# EAGLE design StackUnderflow (EAGLE 5.06)
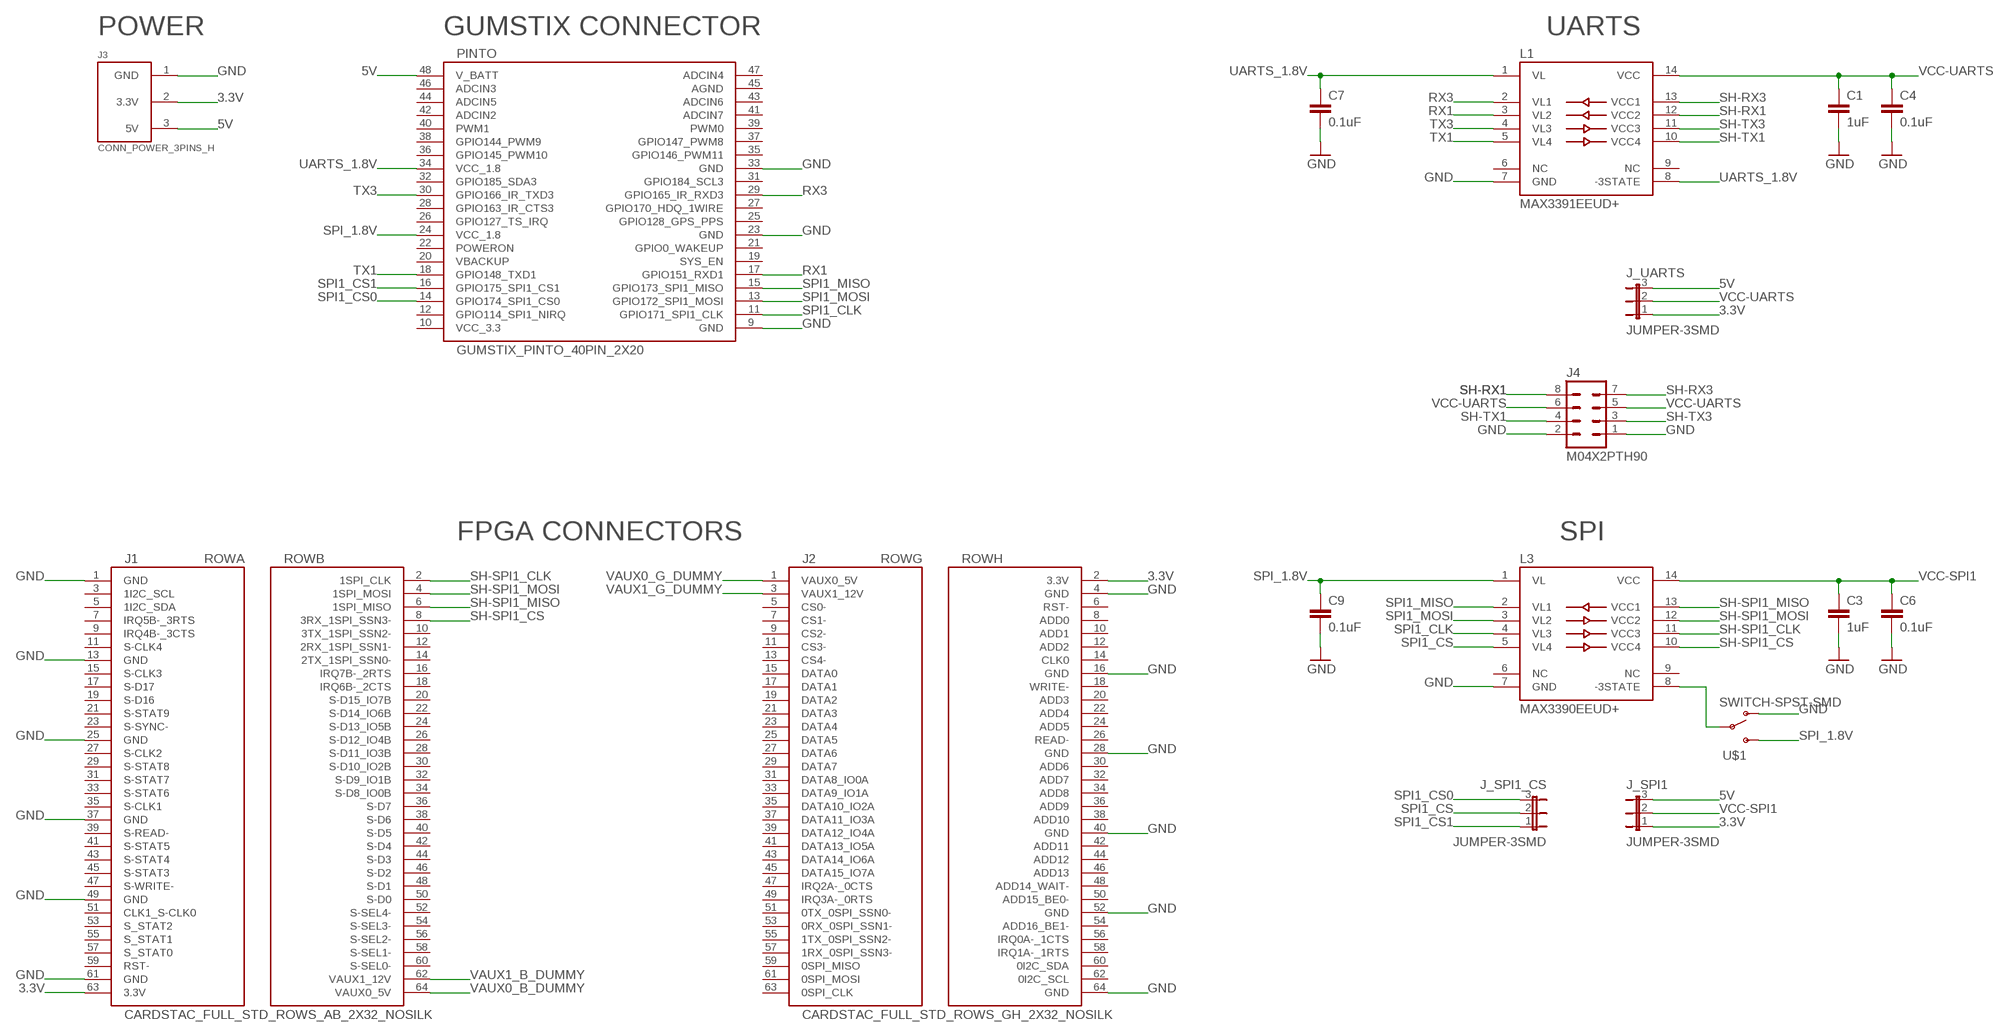
[diagram p0: schematic, sheet 1]

## Parts
C1  1uF  CAP0805  [C0805]
C3  1uF  CAP0805  [C0805]
C4  0.1uF  CAP0805  [C0805]
C6  0.1uF  CAP0805  [C0805]
C7  0.1uF  CAP0805  [C0805]
C9  0.1uF  CAP0805  [C0805]
J1  CARDSTAC_FULL_STD_ROWS_AB_2X32_NOSILK  [2X32/NOSILK]
J2  CARDSTAC_FULL_STD_ROWS_GH_2X32_NOSILK  [2X32/NOSILK]
J3  CONN_POWER_3PINS_H  [3PINS_3.81MM_90DEG]
J4  M04X2PTH90  [2X04/90]
J_SPI1  JUMPER-3SMD  [SJ_3]
J_SPI1_CS  JUMPER-3SMD  [SJ_3]
J_UARTS  JUMPER-3SMD  [SJ_3]
L1  MAX3391EEUD+  [TSSOP-14]
L3  MAX3390EEUD+  [TSSOP-14]
PINTO  GUMSTIX_PINTO_40PIN_2X20  [GUMSTIX_PINTO_40PIN]
U$1  SWITCH-SPST-SMD  [SWITCH-SPST-SMD]

## Nets
3.3V: J1.63(3.3V) J2.2(3.3V) J3.2(3.3V) J_SPI1.1 J_UARTS.1
5V: J3.3(5V) J_SPI1.3 J_UARTS.3 PINTO.48(V_BATT)
GND: C1.2 C3.2 C4.2 C6.2 C7.2 C9.2 J1.1(GND) J1.13(GND) J1.25(GND) J1.37(GND) J1.49(GND) J1.61(GND) J2.4(GND) J2.16(GND) J2.28(GND) J2.40(GND) J2.52(GND) J2.64(GND) J3.1(GND) J4.1 J4.2 L1.7(GND) L3.7(GND) PINTO.9(GND) PINTO.23(GND) PINTO.33(GND) U$1.1(O)
RX1: L1.3(VL2) PINTO.17(GPIO151_RXD1)
RX3: L1.2(VL1) PINTO.29(GPIO165_IR_RXD3)
SH-RX1: J4.8 L1.12(VCC2)
SH-RX3: J4.7 L1.13(VCC1)
SH-SPI1_CLK: J1.2(1SPI_CLK) L3.11(VCC3)
SH-SPI1_CS: J1.8(3RX_1SPI_SSN3-) L3.10(VCC4)
SH-SPI1_MISO: J1.6(1SPI_MISO) L3.13(VCC1)
SH-SPI1_MOSI: J1.4(1SPI_MOSI) L3.12(VCC2)
SH-TX1: J4.4 L1.10(VCC4)
SH-TX3: J4.3 L1.11(VCC3)
SPI1_CLK: L3.4(VL3) PINTO.11(GPIO171_SPI1_CLK)
SPI1_CS: J_SPI1_CS.2 L3.5(VL4)
SPI1_CS0: J_SPI1_CS.3 PINTO.14(GPIO174_SPI1_CS0)
SPI1_CS1: J_SPI1_CS.1 PINTO.16(GPIO175_SPI1_CS1)
SPI1_MISO: L3.2(VL1) PINTO.15(GPIO173_SPI1_MISO)
SPI1_MOSI: L3.3(VL2) PINTO.13(GPIO172_SPI1_MOSI)
SPI_1.8V: C9.1 L3.1(VL) PINTO.24(VCC_1.8) U$1.3(S)
SPI_ENABLE: L3.8(-3STATE) U$1.2(P)
TX1: L1.5(VL4) PINTO.18(GPIO148_TXD1)
TX3: L1.4(VL3) PINTO.30(GPIO166_IR_TXD3)
UARTS_1.8V: C7.1 L1.1(VL) L1.8(-3STATE) PINTO.34(VCC_1.8)
VAUX0_B_DUMMY: J1.64(VAUX0_5V)
VAUX0_G_DUMMY: J2.1(VAUX0_5V)
VAUX1_B_DUMMY: J1.62(VAUX1_12V)
VAUX1_G_DUMMY: J2.3(VAUX1_12V)
VCC-SPI1: C3.1 C6.1 J_SPI1.2 L3.14(VCC)
VCC-UARTS: C1.1 C4.1 J4.5 J4.6 J_UARTS.2 L1.14(VCC)
Unconnected: J1.3(1I2C_SCL) J1.5(1I2C_SDA) J1.7(IRQ5B-_3RTS) J1.9(IRQ4B-_3CTS) J1.10(3TX_1SPI_SSN2-) J1.11(S-CLK4) J1.12(2RX_1SPI_SSN1-) J1.14(2TX_1SPI_SSN0-) J1.15(S-CLK3) J1.16(IRQ7B-_2RTS) J1.17(S-D17) J1.18(IRQ6B-_2CTS) J1.19(S-D16) J1.20(S-D15_IO7B) J1.21(S-STAT9) J1.22(S-D14_IO6B) J1.23(S-SYNC-) J1.24(S-D13_IO5B) J1.26(S-D12_IO4B) J1.27(S-CLK2) J1.28(S-D11_IO3B) J1.29(S-STAT8) J1.30(S-D10_IO2B) J1.31(S-STAT7) J1.32(S-D9_IO1B) J1.33(S-STAT6) J1.34(S-D8_IO0B) J1.35(S-CLK1) J1.36(S-D7) J1.38(S-D6) J1.39(S-READ-) J1.40(S-D5) J1.41(S-STAT5) J1.42(S-D4) J1.43(S-STAT4) J1.44(S-D3) J1.45(S-STAT3) J1.46(S-D2) J1.47(S-WRITE-) J1.48(S-D1) J1.50(S-D0) J1.51(CLK1_S-CLK0) J1.52(S-SEL4-) J1.53(S_STAT2) J1.54(S-SEL3-) J1.55(S_STAT1) J1.56(S-SEL2-) J1.57(S_STAT0) J1.58(S-SEL1-) J1.59(RST-) J1.60(S-SEL0-) J2.5(CS0-) J2.6(RST-) J2.7(CS1-) J2.8(ADD0) J2.9(CS2-) J2.10(ADD1) J2.11(CS3-) J2.12(ADD2) J2.13(CS4-) J2.14(CLK0) J2.15(DATA0) J2.17(DATA1) J2.18(WRITE-) J2.19(DATA2) J2.20(ADD3) J2.21(DATA3) J2.22(ADD4) J2.23(DATA4) J2.24(ADD5) J2.25(DATA5) J2.26(READ-) J2.27(DATA6) J2.29(DATA7) J2.30(ADD6) J2.31(DATA8_IO0A) J2.32(ADD7) J2.33(DATA9_IO1A) J2.34(ADD8) J2.35(DATA10_IO2A) J2.36(ADD9) J2.37(DATA11_IO3A) J2.38(ADD10) J2.39(DATA12_IO4A) J2.41(DATA13_IO5A) J2.42(ADD11) J2.43(DATA14_IO6A) J2.44(ADD12) J2.45(DATA15_IO7A) J2.46(ADD13) J2.47(IRQ2A-_0CTS) J2.48(ADD14_WAIT-) J2.49(IRQ3A-_0RTS) J2.50(ADD15_BE0-) J2.51(0TX_0SPI_SSN0-) J2.53(0RX_0SPI_SSN1-) J2.54(ADD16_BE1-) J2.55(1TX_0SPI_SSN2-) J2.56(IRQ0A-_1CTS) J2.57(1RX_0SPI_SSN3-) J2.58(IRQ1A-_1RTS) J2.59(0SPI_MISO) J2.60(0I2C_SDA) J2.61(0SPI_MOSI) J2.62(0I2C_SCL) J2.63(0SPI_CLK) L1.6(NC) L1.9(NC) L3.6(NC) L3.9(NC) PINTO.10(VCC_3.3) PINTO.12(GPIO114_SPI1_NIRQ) PINTO.19(SYS_EN) PINTO.20(VBACKUP) PINTO.21(GPIO0_WAKEUP) PINTO.22(POWERON) PINTO.25(GPIO128_GPS_PPS) PINTO.26(GPIO127_TS_IRQ) PINTO.27(GPIO170_HDQ_1WIRE) PINTO.28(GPIO163_IR_CTS3) PINTO.31(GPIO184_SCL3) PINTO.32(GPIO185_SDA3) PINTO.35(GPIO146_PWM11) PINTO.36(GPIO145_PWM10) PINTO.37(GPIO147_PWM8) PINTO.38(GPIO144_PWM9) PINTO.39(PWM0) PINTO.40(PWM1) PINTO.41(ADCIN7) PINTO.42(ADCIN2) PINTO.43(ADCIN6) PINTO.44(ADCIN5) PINTO.45(AGND) PINTO.46(ADCIN3) PINTO.47(ADCIN4)

## Notes on the sheet
- POWER | GUMSTIX CONNECTOR | UARTS
- FPGA CONNECTORS | SPI

## Library data of the parts
C1 C3 C4 C6 C7 C9 = Robot:CAP: CAPACITOR
J1 = Robot:CARDSTAC_FULL_STD_ROWS_AB: Rows A and B of the Cardstac specification.
J2 = Robot:CARDSTAC_FULL_STD_ROWS_GH: Rows G and H of the Cardstac specification.
J3 = Robot:CONN_POWER_3PINS: POWER CONNECTOR for logic boards. Provides 3.3V and 5V.
J4 = Robot:M04X2: 8-PIN DUAL ROW HEADER Standard 8-pin dual row 0.1" header.
J_SPI1 J_SPI1_CS J_UARTS = Robot:JUMPER-3: 3-WAY JUMPER
L1 = Robot:MAX3391E: Low-Voltage Level Translator Page du fabricant: http://www.maxim-ic.com/quick_view2.cfm/qv_pk/3253 Datasheet: http://datasheets.maxim-ic.com/en/ds/MAX3372E-MAX3393E.pdf
L3 = Robot:MAX3390E: Low-Voltage Level Translator Page du fabricant: http://www.maxim-ic.com/quick_view2.cfm/qv_pk/3253 Datasheet: http://datasheets.maxim-ic.com/en/ds/MAX3372E-MAX3393E.pdf
PINTO = Robot:GUMSTIX_PINTO_40PIN: Expansion connector of the Pinto daughterboard for Gumstix Overo COMs
U$1 = Robot:SWITCH-SPST: SPST Switch

## Board
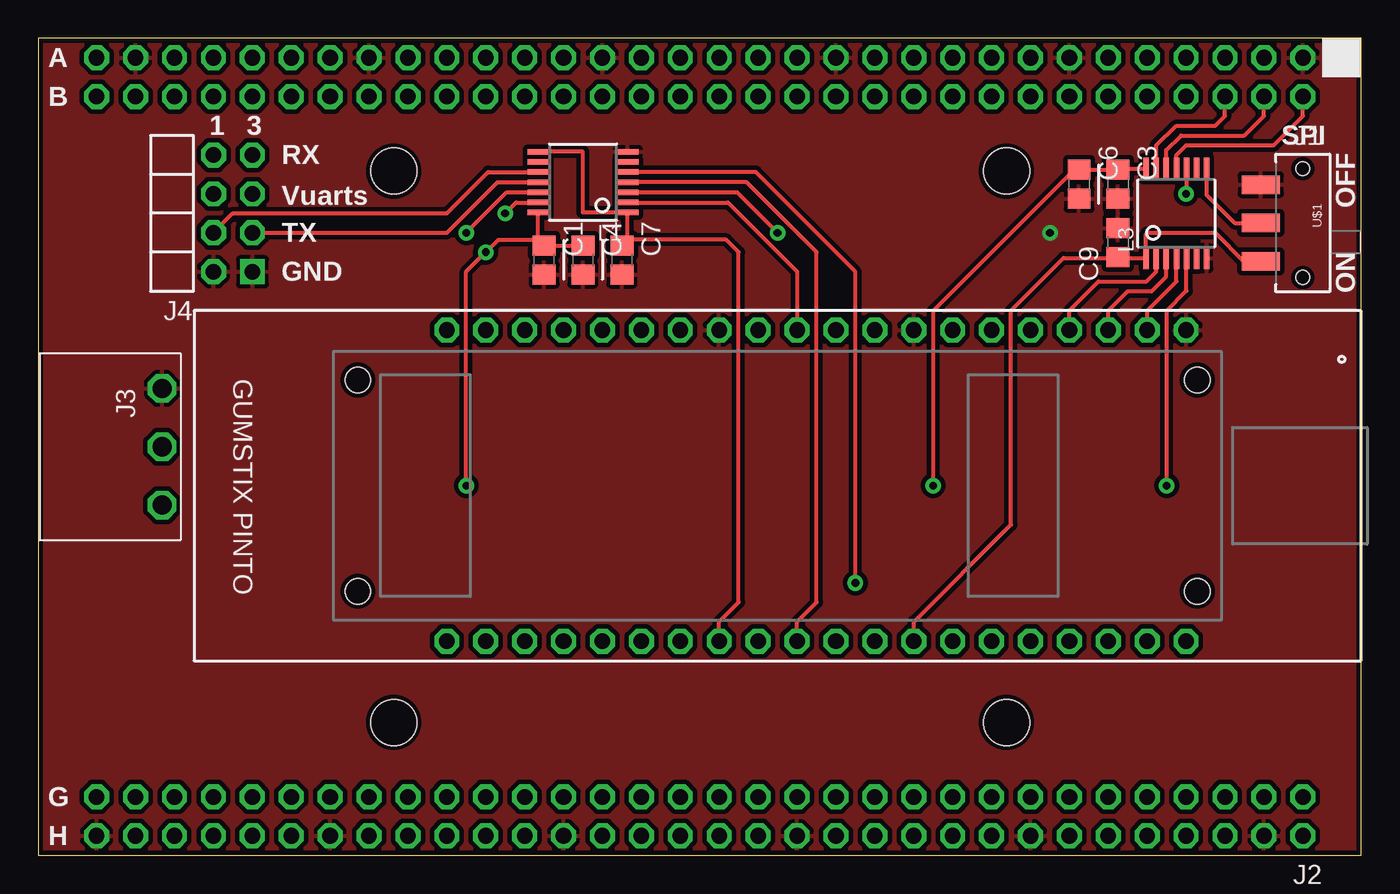
[diagram p1: board, top side]
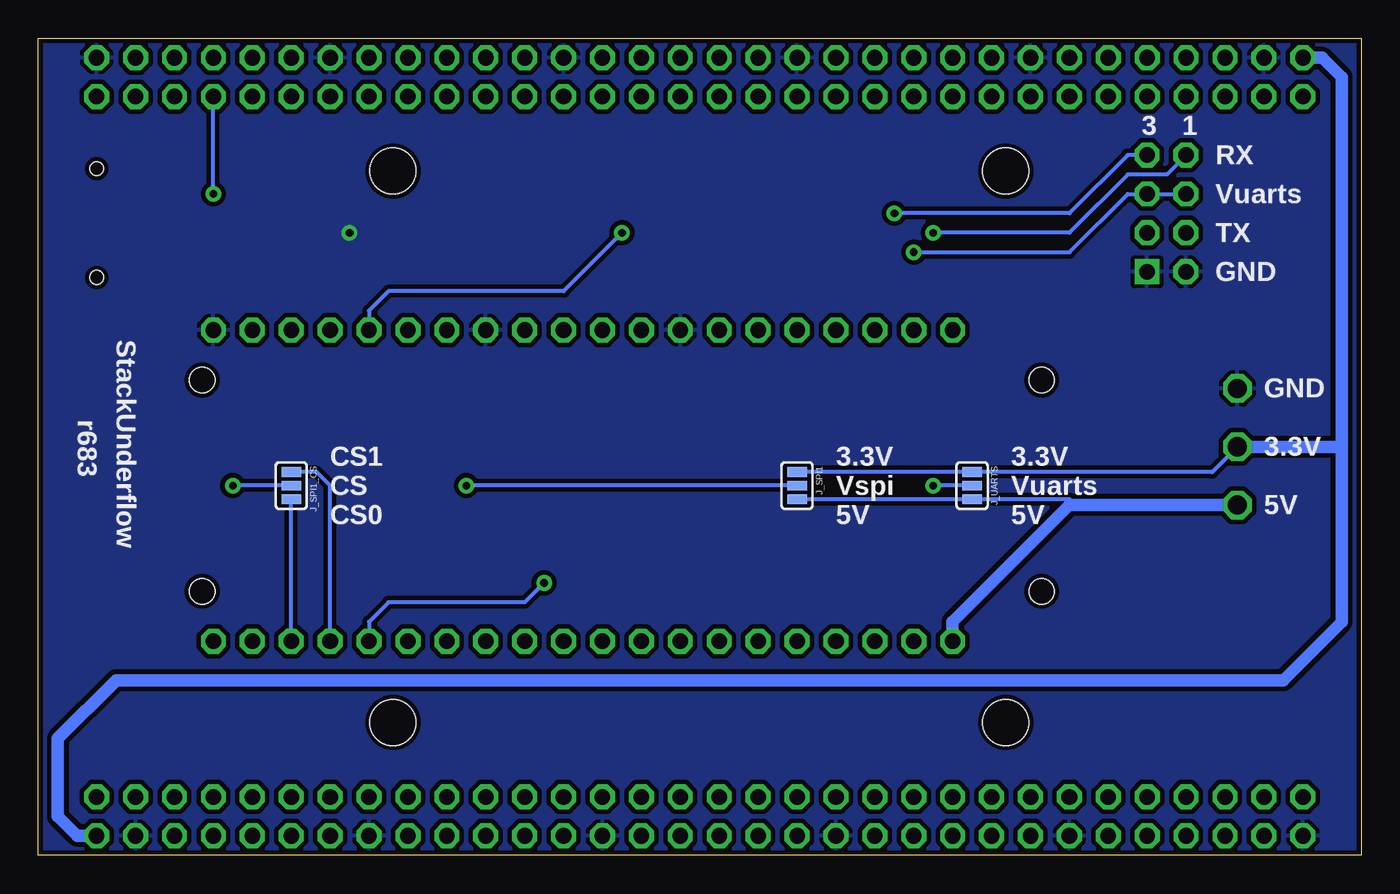
[diagram p2: board, bottom side, seen from below]

Size 86.36 x 53.34 mm. Coordinates in mm from the lower left corner, seen from the top.
Outline: 0,0 86.36,0 86.36,53.34 0,53.34 0,0
Copper layers (1*16): Top 0.035mm / dielectric 1.5mm / Bottom 0.035mm
Design rules "SparkFun": minimum track width 8mil, minimum drill 20mil, track to track 8mil, track to pad 8mil, pad to pad 8mil, via to via 8mil, smd to smd 8mil, copper to edge 10mil, drill to drill 8mil, minimum pad ring 12mil, minimum via ring 10mil, stop-mask expansion 4mil, vias tented up to drill 25mil, thermal gap 10mil
Holes 3 mm at 23.2,44.67 63.2,44.67 23.2,8.67 63.2,8.67

### Footprints (pad centres in the part's own frame; a part is rotated, then mirrored left to right if it is on the bottom)
C0805 = smd 1.3 x 1.5: 1 -0.95,0; 2 0.95,0
2X32/NOSILK = drill 1.016 octagon: 1 -39.37,-1.27; 2 -39.37,1.27; 3 -36.83,-1.27; 4 -36.83,1.27; 5 -34.29,-1.27; 6 -34.29,1.27; 7 -31.75,-1.27; 8 -31.75,1.27; 9 -29.21,-1.27; 10 -29.21,1.27; 11 -26.67,-1.27; 12 -26.67,1.27; 13 -24.13,-1.27; 14 -24.13,1.27; 15 -21.59,-1.27; 16 -21.59,1.27; 17 -19.05,-1.27; 18 -19.05,1.27; 19 -16.51,-1.27; 20 -16.51,1.27; 21 -13.97,-1.27; 22 -13.97,1.27; 23 -11.43,-1.27; 24 -11.43,1.27; 25 -8.89,-1.27; 26 -8.89,1.27; 27 -6.35,-1.27; 28 -6.35,1.27; 29 -3.81,-1.27; 30 -3.81,1.27; 31 -1.27,-1.27; 32 -1.27,1.27; 33 1.27,-1.27; 34 1.27,1.27; 35 3.81,-1.27; 36 3.81,1.27; 37 6.35,-1.27; 38 6.35,1.27; 39 8.89,-1.27; 40 8.89,1.27; 41 11.43,-1.27; 42 11.43,1.27; 43 13.97,-1.27; 44 13.97,1.27; 45 16.51,-1.27; 46 16.51,1.27; 47 19.05,-1.27; 48 19.05,1.27; 49 21.59,-1.27; 50 21.59,1.27; 51 24.13,-1.27; 52 24.13,1.27; 53 26.67,-1.27; 54 26.67,1.27; 55 29.21,-1.27; 56 29.21,1.27; 57 31.75,-1.27; 58 31.75,1.27; 59 34.29,-1.27; 60 34.29,1.27; 61 36.83,-1.27; 62 36.83,1.27; 63 39.37,-1.27; 64 39.37,1.27
3PINS_3.81MM_90DEG = drill 1.25 octagon: 1 -3.81,3; 2 0,3; 3 3.81,3
2X04/90 = drill 1.016 square: 1 -3.81,-1.28 | drill 1.016 octagon: 2 -3.81,1.26; 3 -1.27,-1.28; 4 -1.27,1.26; 5 1.27,-1.28; 6 1.27,1.26; 7 3.81,-1.28; 8 3.81,1.26
SJ_3 = smd 0.635 x 1.27: 1 -0.889,0; 2 0,0; 3 0.889,0
TSSOP-14 = smd 1.422 x 0.356: 1 -2.921,1.981; 2 -2.921,1.321; 3 -2.921,0.66; 4 -2.921,0; 5 -2.921,-0.66; 6 -2.921,-1.321; 7 -2.921,-1.981; 8 2.921,-1.981; 9 2.921,-1.321; 10 2.921,-0.66; 11 2.921,0; 12 2.921,0.66; 13 2.921,1.321; 14 2.921,1.981
GUMSTIX_PINTO_40PIN = drill 1.016 octagon: 9 64.77,21.59; 10 64.77,1.27; 11 62.23,21.59; 12 62.23,1.27; 13 59.69,21.59; 14 59.69,1.27; 15 57.15,21.59; 16 57.15,1.27; 17 54.61,21.59; 18 54.61,1.27; 19 52.07,21.59; 20 52.07,1.27; 21 49.53,21.59; 22 49.53,1.27; 23 46.99,21.59; 24 46.99,1.27; 25 44.45,21.59; 26 44.45,1.27; 27 41.91,21.59; 28 41.91,1.27; 29 39.37,21.59; 30 39.37,1.27; 31 36.83,21.59; 32 36.83,1.27; 33 34.29,21.59; 34 34.29,1.27; 35 31.75,21.59; 36 31.75,1.27; 37 29.21,21.59; 38 29.21,1.27; 39 26.67,21.59; 40 26.67,1.27; 41 24.13,21.59; 42 24.13,1.27; 43 21.59,21.59; 44 21.59,1.27; 45 19.05,21.59; 46 19.05,1.27; 47 16.51,21.59; 48 16.51,1.27 | hole 1.65: 65.5,18.33; 65.5,4.53; 10.7,18.33; 10.7,4.53
SWITCH-SPST-SMD = smd 1.2 x 2.5: 1 -2.5,-2.75; 2 0,-2.75; 3 2.5,-2.75 | hole 0.9: -3.55,0; 3.55,0

### Placement (x,y rotation side)
C1  33.02,38.86 270 top
C3  70.48,43.81 270 top
C4  35.56,38.86 270 top
C6  67.94,43.81 270 top
C7  38.1,38.86 270 top
C9  70.48,40.01 90 top
J1  43.18,50.8 180 top
J2  43.18,2.54 180 top
J3  5.08,26.67 270 top
J4  12.7,41.91 90 top
J_SPI1  36.83,24.13 270 bottom
J_SPI1_CS  69.85,24.13 270 bottom
J_UARTS  25.4,24.13 270 bottom
L1  35.56,43.94 180 top
L3  74.3,41.91 90 top
PINTO  10.16,12.7 0 top
U$1  82.55,41.27 270 top

### Tracks (layer width: path | path; a pad name or v marks a point on that pad's centre or on a via)
3.3V
  Bottom 0.254: J_SPI1.1 J_UARTS.1 9.73,25.02 J3.2
  Bottom 0.813: 1.27,26.67 J3.2 | 1.27,26.67 1.27,15.24 5.08,11.43 81.28,11.43 85.09,7.62 85.09,2.54 83.82,1.27 J2.2 | J1.63 2.54,52.07 1.27,50.8 1.27,26.67
5V
  Bottom 0.254: J_SPI1.3 J_UARTS.3 19.05,23.24 19.05,22.86
  Bottom 0.813: J3.3 19.05,22.86 26.67,15.24 PINTO.48
GND  (via drill 0.51)
  other vias: 66.04,40.64
  pour Bottom (isolate 0.305): 0,0 0,53.34 86.36,53.34 86.36,0
  pour Top (isolate 0.305): 0,0 0,53.34 86.36,53.34 86.36,0
RX1  (via drill 0.51)
  Top 0.254: L1.3 45.62,43.28 v48.26,40.64
  Bottom 0.254: v48.26,40.64 52.07,36.83 63.5,36.83 64.77,35.56 PINTO.17
RX3
  Top 0.254: PINTO.29 49.53,38.1 45.01,42.62 L1.2
SH-RX1  (via drill 0.51)
  Top 0.254: L1.12 30.58,43.28 v27.94,40.64
  Bottom 0.254: J4.8 12.7,44.45 15.24,44.45 19.05,40.64 v27.94,40.64
SH-RX3  (via drill 0.51)
  Top 0.254: L1.13 31.19,42.62 v30.48,41.91
  Bottom 0.254: J4.7 15.24,45.72 19.05,41.91 v30.48,41.91
SH-SPI1_CLK
  Top 0.254: L3.11 74.3,45.72 74.93,46.35 80.64,46.35 82.55,48.26 J1.2
SH-SPI1_CS  (via drill 0.51)
  Top 0.254: L3.10 74.93,44.83 v74.93,43.18
  Bottom 0.254: v74.93,43.18 J1.8
SH-SPI1_MISO
  Top 0.254: L3.13 72.97,46.35 74.3,47.62 76.83,47.62 77.47,48.26 J1.6
SH-SPI1_MOSI
  Top 0.254: L3.12 73.64,46.04 74.61,46.99 78.74,46.99 80.01,48.26 J1.4
SH-TX1
  Top 0.254: J4.4 12.7,41.91 26.67,41.91 29.36,44.6 L1.10
SH-TX3
  Top 0.254: J4.3 26.67,40.64 29.97,43.94 L1.11
SPI1_CLK
  Top 0.254: PINTO.11 72.39,35.56 74.3,37.47 L3.4
SPI1_CS  (via drill 0.51)
  Top 0.254: v73.66,24.13 73.66,35.56 74.95,36.85 L3.5
  Bottom 0.254: J_SPI1_CS.2 v73.66,24.13
SPI1_CS0
  Bottom 0.254: PINTO.14 J_SPI1_CS.3
SPI1_CS1
  Bottom 0.254: J_SPI1_CS.1 68.2,25.02 67.31,24.13 PINTO.16
SPI1_MISO
  Top 0.254: PINTO.15 67.31,35.56 69.22,37.47 72.34,37.47 72.97,38.1 L3.2
SPI1_MOSI
  Top 0.254: PINTO.13 69.85,35.56 71.12,36.83 72.68,36.83 73.64,37.78 L3.3
SPI_1.8V
  Top 0.254: PINTO.24 57.15,15.24 63.5,21.59 63.5,35.56 66.93,38.99 70.48,38.99 | U$1.3 78.7,38.77 76.83,40.64 72.39,40.64 72.31,40.56 L3.1 70.48,38.99 | 70.48,38.99 C9.1
SPI_ENABLE
  Top 0.254: L3.8 76.28,43.1 78.11,41.27 U$1.2
TX1  (via drill 0.51)
  Top 0.254: L1.5 46.84,44.6 53.34,38.1 v53.34,17.78
  Bottom 0.254: v53.34,17.78 54.61,16.51 63.5,16.51 64.77,15.24 PINTO.18
TX3
  Top 0.254: PINTO.30 49.53,15.24 50.8,16.51 50.8,39.37 46.23,43.94 L1.4
UARTS_1.8V
  Top 0.254: 38.48,40.19 L1.1 35.56,41.96 35.56,45.92 L1.8 | 38.48,40.19 C7.1 | PINTO.34 44.45,15.24 45.72,16.51 45.72,39.37 44.9,40.19 38.48,40.19
VCC-SPI1  (via drill 0.51)
  Top 0.254: v58.42,24.13 58.42,35.56 67.62,44.77 C6.1 C3.1 70.48,44.83 L3.14
  Bottom 0.254: J_SPI1.2 v58.42,24.13
VCC-UARTS  (via drill 0.51)
  Top 0.254: 32.64,40.19 L1.14 | 32.64,40.19 C1.1 C4.1 | 32.64,40.19 30.03,40.19 v29.21,39.37 27.94,38.1 v27.94,24.13
  Bottom 0.254: J_UARTS.2 v27.94,24.13 | v29.21,39.37 19.05,39.37 15.24,43.18 J4.5 J4.6

### Text on the board
tPlace: A | B | 1 | 3 | SPI | OFF | RX | Vuarts | TX | GND | ON | G | H
bPlace: 1 | 3 | RX | Vuarts | TX | GND | StackUnderflow | GND | r683 | 3.3V | 3.3V | 3.3V | CS1 | Vuarts | Vspi | CS | 5V | 5V | 5V | CS0